# Altium schematic sheet callisto_schematics.SchDoc
size A3
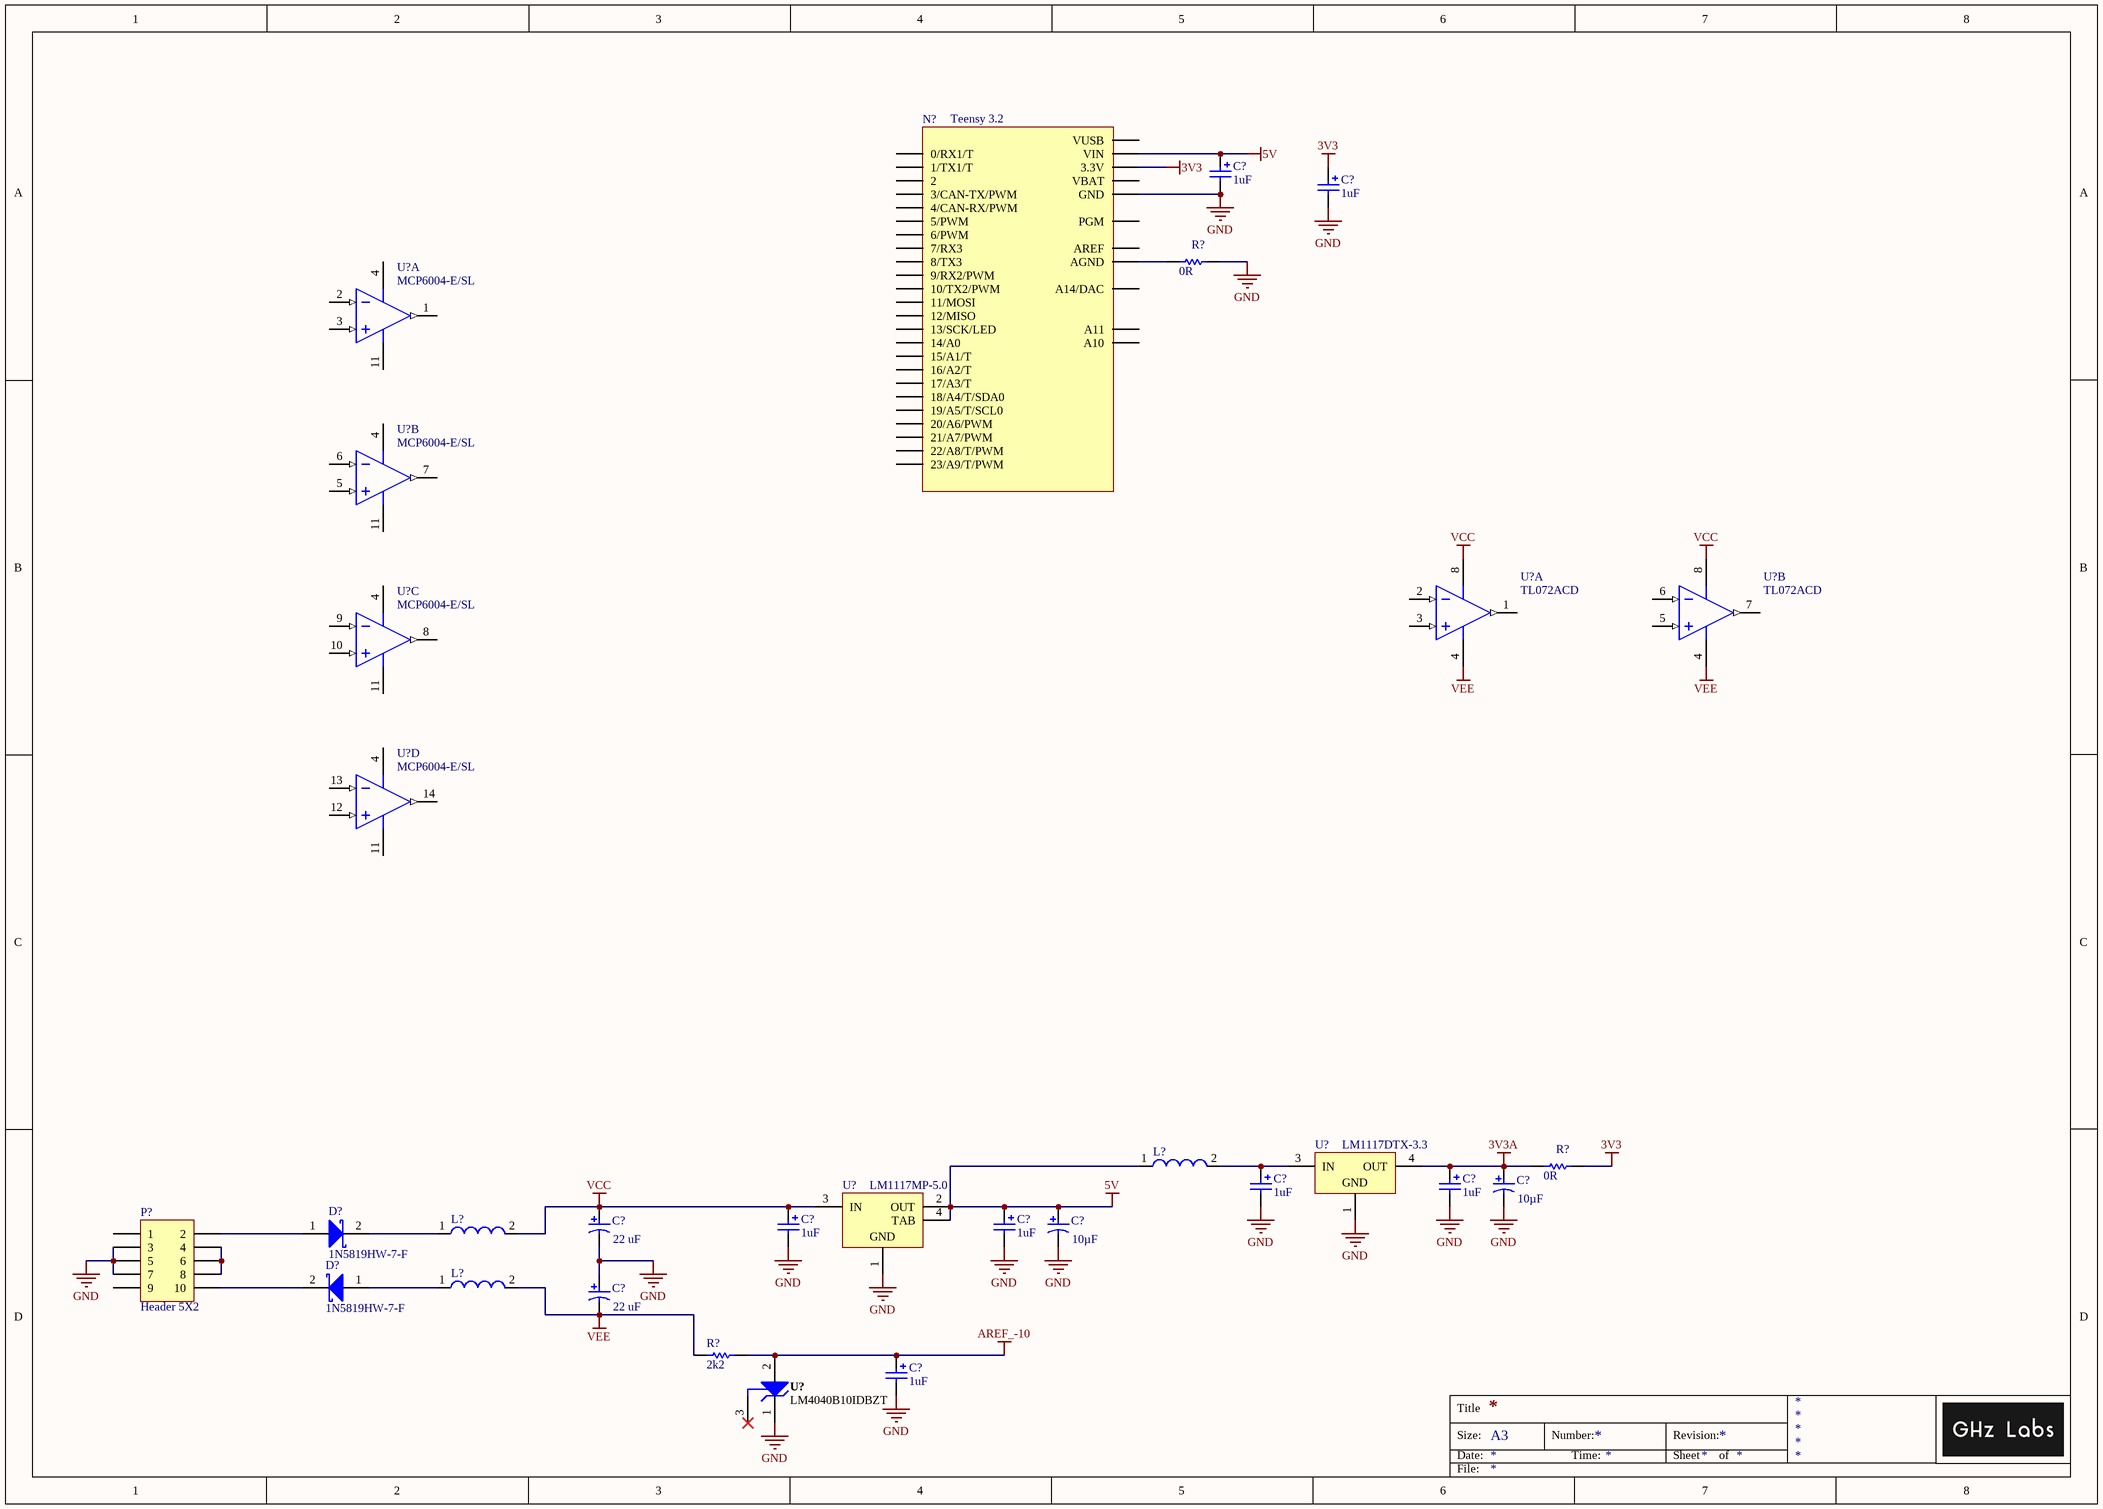
[diagram p0: callisto_schematics.SchDoc]

## Parts
(Parts that share a designator on the sheet are numbered #1, #2 ... from top to bottom, then left to right.)
C?#1  1uF  [CAPA_0805 Pol]
C?#2  1uF  [CAPA_0805 Pol]
C?#3  Capacitance: 10µF  [PNSC-FK-V-B_V]  (hidden comment: EEE-FK1V100UR)
C?#4  1uF  [CAPA_0805 Pol]
C?#5  1uF  [CAPA_0805 Pol]
C?#6  Rated Capacitance: 22 uF  [NIC-CAPA2-5X5.8_V]  (hidden comment: UUD1C220MCL1GS)
C?#7  Capacitance: 10µF  [PNSC-FK-V-B_V]  (hidden comment: EEE-FK1V100UR)
C?#8  1uF  [CAPA_0805 Pol]
C?#9  1uF  [CAPA_0805 Pol]
C?#10  Rated Capacitance: 22 uF  [NIC-CAPA2-5X5.8_V]  (hidden comment: UUD1C220MCL1GS)
C?#11  1uF  [CAPA_0805 Pol]
D?#1  1N5819HW-7-F  [DIOD-SOD-123-2_V]
D?#2  1N5819HW-7-F  [DIOD-SOD-123-2_V]
L?#1  74279201  [SMD-0805]  (value not drawn)
L?#2  74279201  [SMD-0805]  (value not drawn)
L?#3  74279201  [SMD-0805]  (value not drawn)
N?  Teensy 3.2  [TEENSY_3.0-3.2&LC_DIL+4]
P?  Header 5X2  [HDR2X5]
R?#1  0R  [RES_0805]
R?#2  0R  [RES_0805]
R?#3  2k2  [RES_0805]
U?#1  MCP6004-E/SL  [SOIC-SL14_N]  (part A of 4)
U?#2  MCP6004-E/SL  [SOIC-SL14_N]  (part B of 4)
U?#3  TL072ACD  [D0008A_M]  (part A of 2)
U?#4  TL072ACD  [D0008A_M]  (part B of 2)
U?#5  MCP6004-E/SL  [SOIC-SL14_N]  (part C of 4)
U?#6  MCP6004-E/SL  [SOIC-SL14_N]  (part D of 4)
U?#7  LM1117DTX-3.3  [TD03B_N]
U?#8  LM1117MP-5.0  [MP04A_N]
U?#9  LM4040B10IDBZT  [DBZ0003A_L]

## Nets
3V3: C?#2.1 N?.3.3V_3.3V1(3.3V) R?#2.2
3V3A: C?#3.1 C?#5.1 R?#2.1 U?#7.4(OUT)
5V: C?#1.1 C?#7.1 C?#9.1 L?#1.1 N?.VIN U?#8.2(OUT) U?#8.4(TAB)
AREF_-10: C?#11.1 R?#3.1 U?#9.2(ANODE)
GND: C?#1.2 C?#2.2 C?#3.2 C?#4.2 C?#5.2 C?#6.2 C?#7.2 C?#8.2 C?#9.2 C?#10.1 C?#11.2 N?.GND_GND1(GND) P?.3 P?.5 P?.7 R?#1.2 U?#7.1(GND) U?#8.1(GND) U?#9.1(CATHODE)
VCC: C?#6.1 C?#8.1 L?#2.2 U?#3.8(VCC+) U?#4.8(VCC+) U?#8.3(IN)
VEE: C?#10.2 L?#3.2 R?#3.2 U?#3.4(VCC-) U?#4.4(VCC-)
NetC?#4_1: C?#4.1 L?#1.2 U?#7.3(IN)
NetD?#1_1: D?#1.1(A) P?.2
NetD?#1_2: D?#1.2(K) L?#2.1
NetD?#2_1: D?#2.1(A) L?#3.1
NetD?#2_2: D?#2.2(K) P?.10
NetN?_AGND: N?.AGND R?#1.1
NetP?_4: P?.4 P?.6 P?.8

Not connected (* = marked no-connect by the designer): N? 0(0/RX1/T) 1(1/TX1/T) 2 3(3/CAN-TX/PWM) 4(4/CAN-RX/PWM) 5(5/PWM) 6(6/PWM) 7(7/RX3) 8(8/TX3) 9(9/RX2/PWM) 10(10/TX2/PWM) 11(11/MOSI) 12(12/MISO) 13(13/SCK/LED) 14/A0 15/A1(15/A1/T) 16/A2(16/A2/T) 17/A3(17/A3/T) 18/A4(18/A4/T/SDA0) 19/A5(19/A5/T/SCL0) 20/A6(20/A6/PWM) 21/A7(21/A7/PWM) 22/A8(22/A8/T/PWM) 23/A9(23/A9/T/PWM) A10 A11 AREF PGM RESET/DAC(A14/DAC) VBAT VUSB; P? 1 9; U?#1 1(VOUTA) 2(VINA-) 3(VINA+) 4(VDD) 11(VSS); U?#2 4(VDD) 5(VINB+) 6(VINB-) 7(VOUTB) 11(VSS); U?#3 1(OUT1) 2(IN1-) 3(IN1+); U?#4 5(IN2+) 6(IN2-) 7(OUT2); U?#5 4(VDD) 8(VOUTC) 9(VINC-) 10(VINC+) 11(VSS); U?#6 4(VDD) 11(VSS) 12(VIND+) 13(VIND-) 14(VOUTD); U?#9 3(NC)*

## Notes on the sheet
- Title
- Size:
- Date:
- A3
- Number:
- Time:
- Revision:
- Sheet
- of
- File:

## Library data of the parts
C?#1 C?#2 C?#4 C?#5 C?#8 C?#9 C?#11 = Cap Pol2: Polarized Capacitor; PartNumber: GRM21BR61C105KA01L; Manufacturer: Murata Electronics; Value: 1uF; Mouser: http://www.mouser.de/ProductDetail/Murata-Electronics/GRM21BR61C105KA01L/?qs=sGAEpiMZZMs0AnBnWHyRQHqtMhGnfkOVy3Os4ZS1iuU%3d
C?#3 C?#7 = CMP-2000-06211-1: Aluminum Electrolytic Capacitor, 10 uF, +/- 20%, 35 V, 2-Pin SMD (Size Code B), -55 to 105 degC, RoHS, Tape and Reel; Manufacturer: Panasonic; Impedance: 1.35O; Rated Voltage: 35V; Lifetime@Temperature: 2000Hrs@105°C; Ripple Current: 90mA; Type: Can; Manufacturer URL: http://www.panasonic.com/; Package Reference: FK-V-B; Operating Temp Range: -55to+105°C; Series: FK; Datasheet URL: http://industrial.panasonic.com/cdbs/www-data/pdf/RDE0000/ABA0000C1181.pdf; Mounting Technology: SurfaceMount; Package URL: http://industrial.panasonic.com/cdbs/www-data/pdf/RDE0000/DME0000COL48.pdf; Package Description: 2-Pin Electrolytic Aluminum Capacitor, Body 4.3 x 4.3 mm; Datasheet Version: 03/2016; Case Size/Dimension: Ø4x5.8mm; Operating Temp-Max: 105°C
C?#6 C?#10 = CMP-0687-00027-1: Aluminum Electrolytic Capacitor, UD Series, Low Impedance, 22 uF, 16 V, + / - 20%, -55 to 105 degC, Chip Type, 5 x 5.8 mm D x L, Pb-Free, Reel; Manufacturer: Nichicon; Tolerance Rated Capacitance: -20 to 20%; Endurance Time: 2000 h; Impedance: 0.76 Ohm; Rated Voltage: 16 V; Rated Ripple Current (at 100kHz): 150 mA; Packing: Dia382mm Reel; PartNumber: UUD1C220MCL1GS; RoHS: TRUE; ComponentLink1URL: http://www.nichicon.co.jp/; PackageReference: CAPAE-D5H5.8; ComponentLink2URL: http://products.nichicon.co.jp/en/pdf/XJA043/e-ud.pdf; ComponentLink3URL: http://products.nichicon.co.jp/en/pdf/XJA043/e-ud.pdf; PackageDescription: 2-Pin Surface Mount Device, Diameter 5 mm, Height 5.8 mm, Pitch 4.4 mm; DatasheetVersion: 08/2012; Mounting Technology: Surface Mount; ComponentLink1Description: Manufacturer URL; Diameter: 5 mm; ComponentLink2Description: Datasheet; Length: 5.8 mm; ComponentLink3Description: Package Specification
D?#1 D?#2 = CMP-0303-00003-1: 1.0 A Surface Mount Schottky Barrier Rectifier, 40 V, -65 to 125 degC, 2-Pin SOD-123 Package, RoHS, Tape and Reel; Manufacturer: Diodes Inc; @ VR (V): 40; @ Terminal Temperature TT (degC): 90; Maximum Average Rectified Current IO (A): 1; Total Capacitance CT (pF): 50; Peak Forward Surge Current IFSM (A): 25; Forward Voltage Drop VF (V): 0.45; VR (RMS) (V): 28; RoHS: TRUE; PartNumber: 1N5819HW-7-F; ComponentLink2URL: http://www.diodes.com/datasheets/ds30217.pdf; PackageDescription: 2-Pin SOD-123, Body 2.7 x 1.55 mm, Pitch 3.7 mm; @ IF (A): 1; Operating and Storage Temperature Range: -65 to 125 degC; ComponentLink1Description: Manufacturer URL; ComponentLink2Description: Datasheet; ComponentLink1URL: http://www.diodes.com/; Mounting Technology: Surface Mount; DatasheetVersion: Rev. 15-2; PackageReference: SOD-123-2; Maximum Reverse Current IR (uA): 50; Peak Repetitive Reverse Voltage VRRM (V): 40; Packing: Tape and Reel
L?#1-L?#3 = 74279201: SMD EMI Suppression Ferrite Bead WE-CBF, Z = 32 Ohm; Impedance: 32 Ohm; DatasheetVersion: Dec-2005; PackageVersion: 2005; PackageReference: SMD-0805; PackageDescription: Chip Inductor, 2-Leads, Body 2.0 x 1.2 mm; ComponentLink1Description: Manufacturer URL; ComponentLink1URL: http://www.we-online.com; ComponentLink2Description: Datasheet; ComponentLink2URL: http://www.we-online.de/katalog/media/pdf/74279201.pdf
N? = TEENSY_3.1-3.2_ALL_PINS: pin to pad: 3.3V 3.3V1>3.3V GND GND1>GND; PartNumber: DEV-13736; Manufacturer: SparkFun; Mouser: http://www.mouser.de/ProductDetail/SparkFun/DEV-13736/?qs=sGAEpiMZZMuWWq7rhECaKVjnUlbUDjFgBj37EAXueZA%3d
P? = Header 5X2: Header, 5-Pin, Dual row; LatestRevisionDate: 17-Jul-2002; LatestRevisionNote: Re-released for DXP Platform.; Publisher: Altium Limited
R?#1 R?#2 = Resistor: 0R 0805; PartNumber: RR1220P-104-D; Manufacturer: Susumu; Value: 0R; Mouser: http://www.mouser.de/ProductDetail/Susumu/RR1220P-104-D/?qs=sGAEpiMZZMu61qfTUdNhG%2fDhcyQpRg8MUHr%252b%2fl2FgBo%3d
R?#3 = Resistor: 10k 0805; PartNumber: RR1220P-103-D; Manufacturer: Susumu; Value: 2k2; Mouser: http://www.mouser.de/ProductDetail/Susumu/RR1220P-103-D/?qs=sGAEpiMZZMu61qfTUdNhG%2fDhcyQpRg8MdkVTtHR2gV4%3d
U?#1 U?#2 U?#5 U?#6 = MCP6004-E/SL: 1 MHz, Low-Power Operational Amplifier, 14-Pin SOIC, Extended Temperature; PartNumber: MCP6004T-E/SL; Manufacturer: Microchip Technology; Published: 29-Jan-2009; LatestRevisionDate: 02-Dec-2009; LatestRevisionNote: Updated to datasheet revision J, Nov-2009; DatasheetVersion: revJ, Nov-2009; PackageVersion: revBB, Aug-2009; PackageReference: SOIC-SL14; Publisher: Altium Limited; PackageDescription: 14-Lead Plastic Small Outline (SL) - Narrow, 3.90mm Body [SOIC]; Supplier 1: Digi-Key; Supplier Part Number 1: MCP6004-E/SL-ND; Supplier 2: Farnell; Supplier Part Number 2: 1332122; Code_JEDEC: MS-012-AB; Code_IPC: SOIC127P600-14; ComponentLink1Description: Datasheet; ComponentLink1URL: http://ww1.microchip.com/downloads/en/DeviceDoc/21733j.pdf; ComponentLink2Description: Packaging Specification; ComponentLink2URL: http://www.microchip.com/stellent/groups/techpub_sg/documents/packagingspec/en012702.pdf; ComponentLink3Description: Microchip.com Home; ComponentLink3URL: http://www.microchip.com/; Mouser: http://www.mouser.de/ProductDetail/Microchip-Technology/MCP6004T-E-SL/?qs=sGAEpiMZZMtCHixnSjNA6N5WMYiF%252b1miedbE5%2f40CfM%3d
U?#3 U?#4 = CMP-0015-00092-2: Low-Noise JFET-Input Operational Amplifier, 7 to 36 V, 0 to 70 degC, 8-pin SOIC (D8), Green (RoHS & no Sb/Br); Manufacturer: Texas Instruments; Iq per channel(Max)(mA): 2.5; Total Supply Voltage(Max)(+5V is 5, +/-5V is 10): 36; Total Supply Voltage(Min)(+5V is 5, +/-5V is 10): 7; GBW(Typ)(MHz): 3; Sub Family: General Purpose Amplifier, High Supply Voltage Amplifier (>=30V); Number of Channels: 2; CMRR(Min)(dB): 75; Vn at 1kHz(Typ)(nV/rtHz): 18; Vio (25C)(Max)(mV): 6; Rating: Catalog; Slew Rate(Typ)(V/us): 13; IIB(Max)(pA): 200; PartNumber: TL072ACD; ComponentLink3Description: Package Specification; PackageDescription: 8-Pin Plastic Small Outline, Body 4.9 x 3.9 mm, Pitch 1.27 mm; ComponentLink1Description: Manufacturer URL; PackageVersion: 4040047-3/M, 06/2011; ComponentLink1URL: http://www.ti.com/; Code_JEDEC: MS-012; Mounting Technology: Surface Mount; ComponentLink3URL: http://www.ti.com/litv/pdf/msoi002j; ComponentLink2Description: Datasheet; Offset Drift(Typ)(uV/C): 18; PackageReference: D0008A; DatasheetVersion: SLOS080J; ComponentLink2URL: http://www.ti.com/lit/ds/symlink/tl072a.pdf; Eco-Plan: Green (RoHS & no Sb/Br)
U?#7 = CMP-0062-00706-2: 800mA Low-Dropout Linear Regulator, 3-pin TO-252; Manufacturer: National Semiconductor; PackageTopMarking: NSUZXYTT*LM1117*DT-3.3; PowerWise: N; CompType: LDO IC; ComponentLink3URL: http://www.national.com/packaging/folders/td03b.html; ComponentLink2URL: http://www.national.com/pf/LM/LM1117.html; ComponentLink2Description: LM1117 Web Page; PinCount: 3; ComponentLink1URL: http://www.national.com/ds/LM/LM1117.pdf; ComponentLink3Description: TD03B Package Page; Code_JEDEC: TO-252-AA; ComponentLink1Description: LM1117 Datasheet; PackageVersion: revD, Feb-2009; RevisionNote: Component URLs added; RoHS: N; DatasheetVersion: Apr-2006; PackageReference: TD03B; PackageDescription: TO252, Molded, Jedec, 6.8 x 6.10 x 2.30mm Body, 3 Lead, 2.28mm Pitch, Surface Mount
U?#8 = CMP-0062-01640-3: 800mA Low-Dropout Linear Regulator, 4-pin SOT-223; Manufacturer: National Semiconductor; CompType: LDO IC; PackageTopMarking: XYTT*N06A; High-Reliability: Y; PowerWise: N; Code_IPC: SOT223-4; PackageVersion: revB, Apr-2003; RoHS: N; Code_JEDEC: TO-261-AA; PinCount: 4; ComponentLink1URL: http://www.national.com/; ComponentLink4URL: http://www.national.com/packaging/folders/mp04a.html; RevisionNote: SCH symbol layout adjusted; PackageDescription: Molded SOT-223, 6.50 x 3.56 x 1.6mm Body, 4 Lead, 2.3mm Pitch; DatasheetVersion: Apr-2006; ComponentLink3URL: http://www.national.com/pf/LM/LM1117.html; ComponentLink2URL: http://www.national.com/ds/LM/LM1117.pdf; PartNumber: LM1117MP-5.0; ComponentLink2Description: LM1117 Datasheet; ComponentLink3Description: LM1117 Web Page; ComponentLink4Description: MP04A Package Page; PackageReference: MP04A; ComponentLink1Description: Manufacturer URL
U?#9 = CMP-0366-01043-2: Precision Micropower Shunt Voltage Reference, 0.2% Accuracy, 10 V, 15 ppm / degC, 15 mA, -40 to 85 degC, 3-pin SOT-23 (DBZ), Green (RoHS & no Sb/Br); Manufacturer: Texas Instruments; Temp Coeff(Max)(ppm/ degree C): 100; Rating: Catalog; VO(V): 10; Iout/Iz(Max)(mA): 15; Initial Accuracy @ 25/deg C(%): 0.2; ComponentLink2Description: Datasheet; ComponentLink1URL: http://www.ti.com/; ComponentLink4URL: Samples URL:http://www.ti.com/product/lm4040b10; ComponentLink3Description: Package Specification; PartNumber: LM4040B10IDBZT; DatasheetVersion: SLOS456K; Mounting Technology: Surface Mount; Eco-Plan: Green (RoHS & no Sb/Br); Code_JEDEC: TO-236; SubFamily: Shunt Voltage Reference; PackageDescription: 3-Pin Plastic Small Outline, Body 2.92 x 1.3 mm, Pitch 0.95 mm; ComponentLink2URL: http://www.ti.com/general/docs/lit/getliterature.tsp?genericPartNumber=LM4040B10&fileType=pdf; PackageVersion: 4203227/B; ComponentLink1Description: Manufacturer URL; ComponentLink3URL: http://www.ti.com/litv/pdf/mpds108a; Temp Coeff(Typ)(ppm/ degree C): 15; ComponentLink4Description: URL Link1; Min Iz for Regulation(uA): 100; PackageReference: DBZ0003A